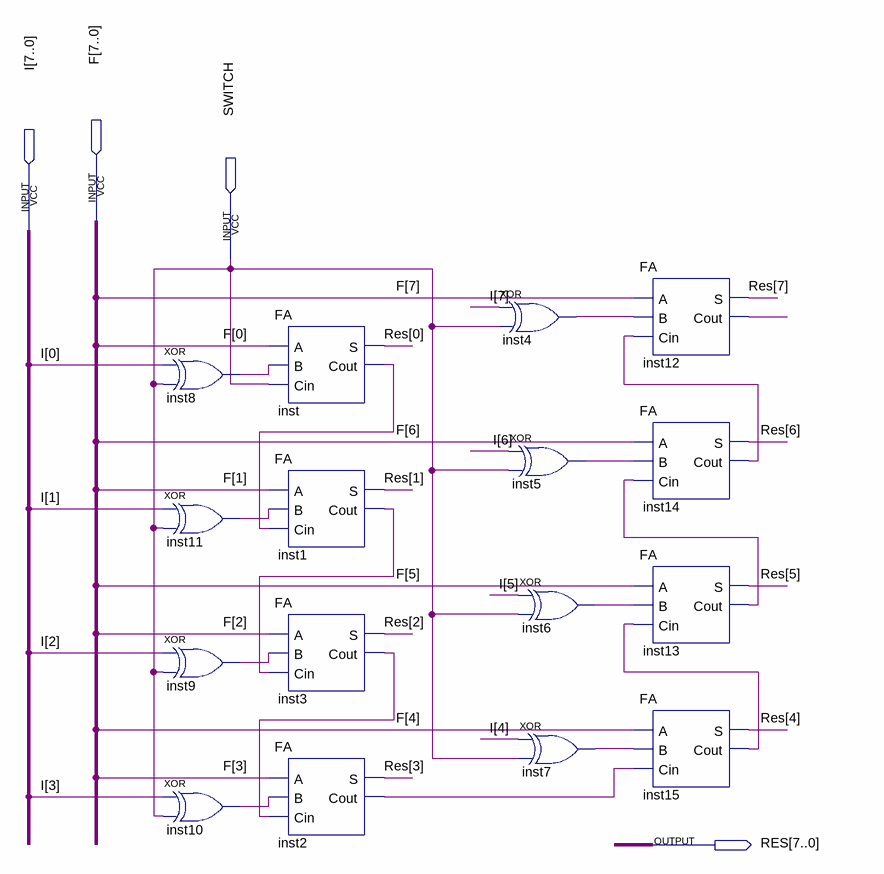
[diagram p0: schematic sheet]
// Quartus schematic ADDSUB8.bdf as structural Verilog: 16 symbols, 4 pins
module ADDSUB8 (
  input  [7:0] F,
  input  [7:0] I,
  input  SWITCH,
  output [7:0] RES
);

  wire inst1_cout, inst2_cout, inst3_cout, inst4_out, inst5_out, inst6_out, inst7_out, inst8_out, inst9_out,
       inst10_out, inst11_out, inst12_cout, inst13_cout, inst14_cout, inst15_cout, inst_cout;

  xor inst8 (inst8_out, I[0], SWITCH);
  xor inst11 (inst11_out, I[1], SWITCH);
  xor inst9 (inst9_out, I[2], SWITCH);
  xor inst10 (inst10_out, I[3], SWITCH);
  FA inst (.A(F[0]), .B(inst8_out), .Cin(SWITCH), .S(RES[0]), .Cout(inst_cout));
  FA inst1 (.A(F[1]), .B(inst11_out), .Cin(inst_cout), .S(RES[1]), .Cout(inst1_cout));
  FA inst3 (.A(F[2]), .B(inst9_out), .Cin(inst1_cout), .S(RES[2]), .Cout(inst3_cout));
  FA inst2 (.A(F[3]), .B(inst10_out), .Cin(inst3_cout), .S(RES[3]), .Cout(inst2_cout));
  xor inst4 (inst4_out, I[7], SWITCH);
  xor inst5 (inst5_out, I[6], SWITCH);
  xor inst6 (inst6_out, I[5], SWITCH);
  xor inst7 (inst7_out, I[4], SWITCH);
  FA inst12 (.A(F[7]), .B(inst4_out), .Cin(inst14_cout), .S(RES[7]), .Cout(inst12_cout));
  FA inst14 (.A(F[6]), .B(inst5_out), .Cin(inst13_cout), .S(RES[6]), .Cout(inst14_cout));
  FA inst13 (.A(F[5]), .B(inst6_out), .Cin(inst15_cout), .S(RES[5]), .Cout(inst13_cout));
  FA inst15 (.A(F[4]), .B(inst7_out), .Cin(inst2_cout), .S(RES[4]), .Cout(inst15_cout));
endmodule
